# EAGLE design MKRCANShieldV2.0 (EAGLE 9.1.3)
DESCRIPTION: microOBD 200 OBD-II Module; HW_REV: 1.4; PCB_REV: C; PCB_SPEC1: Layer Count: 4; PCB_SPEC2: Size: 1.3" x 0.59"; PCB_SPEC3: Finish Thickness: 0.049" - 0.052"; PCB_SPEC4: Copper Weight: 1oz; TITLE: STM1120
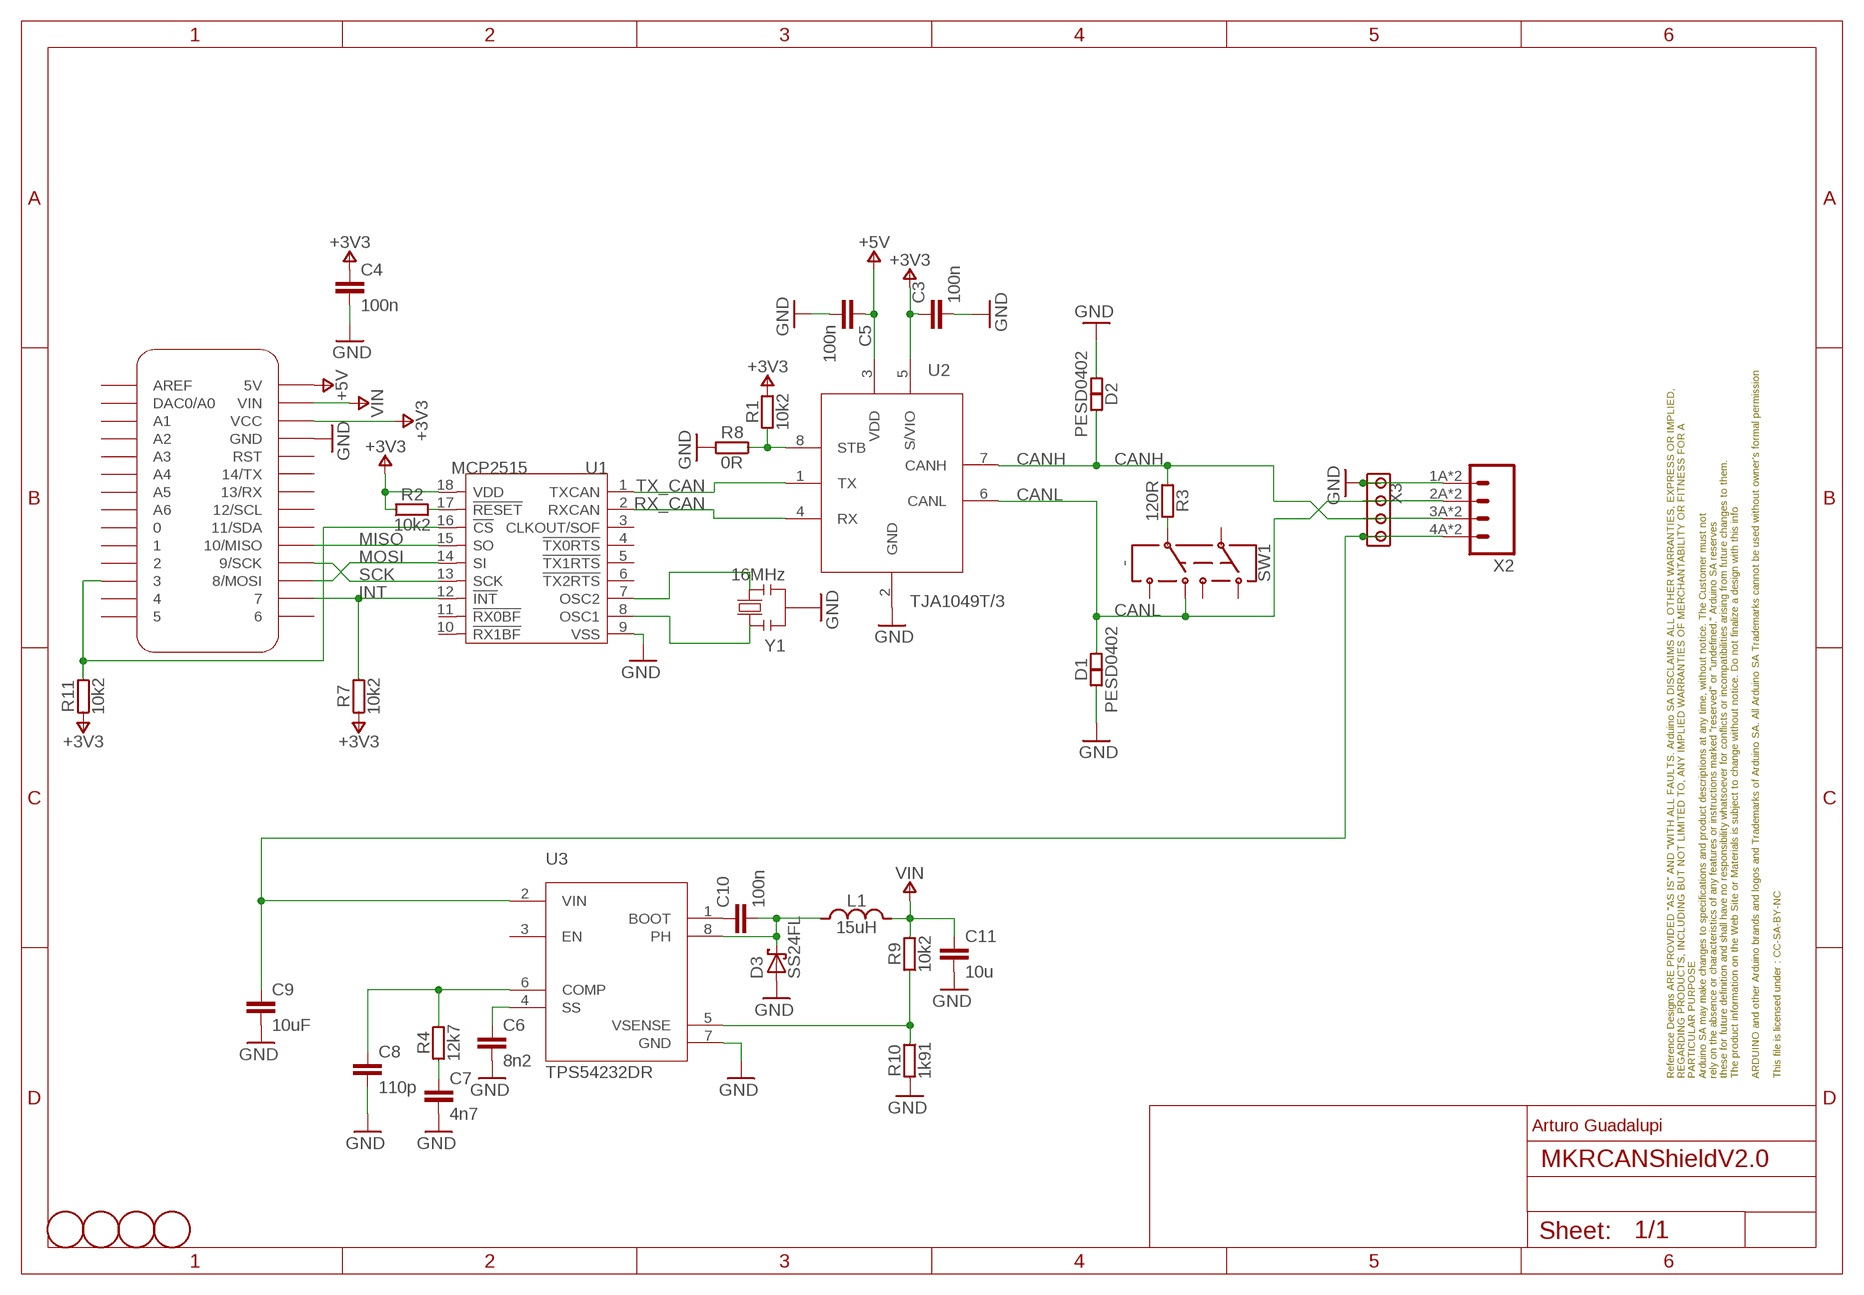
[diagram p0: schematic, sheet 1]

## Parts
C3  100n  C-100NF-0402  [0402-1005X55N]
C4  100n  C-100NF-0402  [0402-1005X55N]
C5  100n  C-100NF-0402  [0402-1005X55N]
C6  8n2  C-8N2-0402  [0402-1005X55N]
C7  4n7  C-4N7-0402  [0402-1005X55N]
C8  110p  C-110P-0402  [0402-1005X55N]
C9  10uF  C-10UF-1206  [C1206]
C10  100n  C-100NF-0402  [0402-1005X55N]
C11  10u  C-10UF-0603  [0603-1608X90N]
D1  PESD0402  PESD  [0402-1005X55N]
D2  PESD0402  PESD  [0402-1005X55N]
D3  SS24FL  [SOD123F]
FRAME1  DNP  A4L-LOC  [FRAME]
L1  15uH  LSRN  [SRN6045]
MKR1  -  MKRBOARD  [MKRBOARD-NH]
R1  10k2  R-10K2-0402  [0402-1005X55N]
R2  10k2  R-10K2-0402  [0402-1005X55N]
R3  120R  R-120R-0402  [0402-1005X55N]
R4  12k7  R-12K7-0402  [0402-1005X55N]
R7  10k2  R-10K2-0402  [0402-1005X55N]
R8  0R  R-0R-0402  [0402-1005X55N]
R9  10k2  R-10K2-0402  [0402-1005X55N]
R10  1k91  R-1K91-0402  [0402-1005X55N]
R11  10k2  R-10K2-0402  [0402-1005X55N]
SW1  -  CL-SB-22A-02T  [CL-SB-22A]
U1  MCP2515  MCP2515-SOIC18  [SOIC18]
U2  TJA1049T/3  TJA104X-9T/3  [SO08]
U3  TPS54232DR  TPS54232  [SO08]
U$1  DNP  FIDUCIAL-1.5MM  [FD-1-1.5]
U$4  DNP  FIDUCIAL-1.5MM  [FD-1-1.5]
U$6  DNP  FIDUCIAL-1.5MM  [FD-1-1.5]
U$13  DNP  FIDUCIAL-1.5MM  [FD-1-1.5]
X2  DNP  3.5MM-PCB-DNPPRESS  [SPTAF1/4-3.5-IL]
X3  -  SCREW4X2.54  [MODULINO-4]
Y1  16MHz  RESONATOR-16MHZMU  [RESONATOR]

## Nets
+3V3: C3.1 C4.1 MKR1.VCC R1.2 R2.2 R7.2 R11.2 U1.18(VDD) U2.5(S/VIO)
+5V: C5.1 MKR1.5V U2.3(VDD)
CANH: D2.2 R3.1 U2.7(CANH) X2.3A X2.3B X3.3
CANL: D1.2 SW1.P$4 U2.6(CANL) X2.2A X2.2B X3.2
GND: C3.2 C4.2 C5.2 C6.2 C7.2 C8.2 C9.2 C11.2 D1.1 D2.1 D3.A MKR1.GND R8.1 R10.1 U1.9(VSS) U2.2(GND) U3.7(GND) X2.1A X2.1B X3.1 Y1.2
INT: MKR1.7 R7.1 U1.12(!INT)
MISO: MKR1.10(10/MISO) U1.15(SO)
MOSI: MKR1.8(8/MOSI) U1.14(SI)
N$1: R3.2 SW1.P$5
N$2: C7.1 R4.1
N$4: R1.1 R8.2 U2.8(STB)
N$5: C8.1 R4.2 U3.6(COMP)
N$6: C6.1 U3.4(SS)
N$8: C9.1 U3.2(VIN) X2.4A X2.4B X3.4
N$9: C10.1 U3.1(BOOT)
N$10: C10.2 D3.C L1.1 U3.8(PH)
N$11: R9.1 R10.2 U3.5(VSENSE)
N$12: MKR1.3 R11.1 U1.16(!CS)
N$16: U1.7(OSC2) Y1.3
N$17: U1.8(OSC1) Y1.1
RST_N: R2.1 U1.17(!RESET)
RX_CAN: U1.2(RXCAN) U2.4(RX)
SCK: MKR1.9(9/SCK) U1.13(SCK)
TX_CAN: U1.1(TXCAN) U2.1(TX)
VIN: C11.1 L1.2 MKR1.VIN R9.2
Unconnected: MKR1.0 MKR1.1 MKR1.2 MKR1.4 MKR1.5 MKR1.6 MKR1.11(11/SDA) MKR1.12(12/SCL) MKR1.13(13/RX) MKR1.14(14/TX) MKR1.A0(DAC0/A0) MKR1.A1 MKR1.A2 MKR1.A3 MKR1.A4 MKR1.A5 MKR1.A6 MKR1.AREF MKR1.RST SW1.P$1 SW1.P$2 SW1.P$3 SW1.P$6 U1.3(CLKOUT/SOF) U1.4(!TX0RTS) U1.5(!TX1RTS) U1.6(!TX2RTS) U1.10(!RX1BF) U1.11(!RX0BF) U3.3(EN)

## Notes on the sheet
- Arturo Guadalupi

## Library data of the parts
C3-C5 C10 = Arduino-rcl:C: SMD Capacitor; CODE-ARDUINO: 0132; DATASHEET: http://www.tdk.com/pdf/TDKMLCCCapRange.pdf; DISTRIBUTOR-LINK: http://www.digikey.com/product-detail/en/tdk-corporation/C1005X5R1H104K050BB/445-5942-1-ND/2443982; DISTRIBUTOR-PN: 445-5942-1-ND; MANUFACTURER: TDK; MANUFACTURER-PN: C1005X5R1H104K050BB; NOTE: -
C6 = Arduino-rcl:C: SMD Capacitor; CODE-ARDUINO: 2263; DATASHEET: http://www.yageo.com/documents/recent/UPY-GPHC_X7R_6.3V-to-50V_18.pdf; DISTRIBUTOR-LINK: https://www.digikey.com/product-detail/en/yageo/CC0402KRX7R7BB822/311-1041-1-ND/302958; DISTRIBUTOR-PN: 311-1041-1-ND; MANUFACTURER: Yageo; MANUFACTURER-PN: CC0402KRX7R7BB822; NOTE: -
C7 = Arduino-rcl:C: SMD Capacitor; CODE-ARDUINO: 2266; DATASHEET: http://search.murata.co.jp/Ceramy/image/img/A01X/partnumbering_e_01.pdf; DISTRIBUTOR-LINK: https://www.digikey.com/product-detail/en/murata-electronics-north-america/GRM155R71H472KA01J/490-8259-1-ND/4380553; DISTRIBUTOR-PN: 490-8259-1-ND; MANUFACTURER: Murata; MANUFACTURER-PN: GRM155R71H472KA01J; NOTE: -
C8 = Arduino-rcl:C: SMD Capacitor; CODE-ARDUINO: 2264; DATASHEET: http://search.murata.co.jp/Ceramy/image/img/A01X/G101/ENG/GRM1555C1H111GA01-01.pdf; DISTRIBUTOR-LINK: https://www.digikey.com/product-detail/en/murata-electronics-north-america/GRM1555C1H111GA01D/490-6195-1-ND/3845392; DISTRIBUTOR-PN: 490-6195-1-ND; MANUFACTURER: Murata; MANUFACTURER-PN: GRM1555C1H111GA01D; NOTE: -
C9 = Arduino-rcl:C: SMD Capacitor; CODE-ARDUINO: 2227; DATASHEET: https://product.tdk.com/info/en/catalog/datasheets/mlcc_commercial_general_en.pdf; DISTRIBUTOR-LINK: https://www.digikey.com/product-detail/en/tdk-corporation/C3216X7R1V106M160AC/445-8034-1-ND/2792174; DISTRIBUTOR-PN: 445-8034-1-ND; MANUFACTURER: TDK Corporation; MANUFACTURER-PN: C3216X7R1V106M160AC; NOTE: -; RESTRICTIONS: >=25V
C11 = Arduino-rcl:C: SMD Capacitor; CODE-ARDUINO: 2213; DATASHEET: http://www.murata.com/~/media/webrenewal/support/library/catalog/products/capacitor/mlcc/c02e.pdf; DISTRIBUTOR-LINK: http://www.digikey.com/product-search/en?keywords=490-10728-1-ND; DISTRIBUTOR-PN: 490-10728-1-ND; MANUFACTURER: Murata; MANUFACTURER-PN: GRM188R61C106KAALD; NOTE: -
D1 D2 = Arduino-diodes:PESD: ESD protection; CODE-ARDUINO: 2280; DATASHEET: http://www.littelfuse.com/~/media/electronics/product_specifications/polymer_esd_suppressors/littelfuse_polymer_esd_suppressor_pesd0402_140_product_specification.pdf.pdf; DISTRIBUTOR-LINK: https://www.digikey.com/product-detail/en/littelfuse-inc/PESD0402-140/PESD0402-140CT-ND/1968526; DISTRIBUTOR-PN: PESD0402-140CT-ND; MANUFACTURER: Littlefuse; MANUFACTURER-PN: PESD0402-140
D3 = Arduino-diodes:SS24FL: Schotky diode; CODE-ARDUINO: 2262; DATASHEET: https://www.fairchildsemi.com/datasheets/SS/SS24FL.pdf; DISTRIBUTOR-LINK: https://www.digikey.com/product-detail/en/fairchild-on-semiconductor/SS24FL/SS24FLCT-ND/5305093; DISTRIBUTOR-PN: SS24FLCT-ND; MANUFACTURER: Fairchild; MANUFACTURER-PN: SS24FL
FRAME1 = Arduino-utility:A4L-LOC: FRAME DIN A4, landscape with location and doc. field; CODE-ARDUINO: DNP; DATASHEET: DNP; DISTRIBUTOR-LINK: DNP; DISTRIBUTOR-PN: DNP; MANUFACTURER: DNP; MANUFACTURER-PN: DNP
L1 = Arduino-rcl:L: Inductors; CODE-ARDUINO: 2261; DATASHEET: http://pdf1.alldatasheet.com/datasheet-pdf/view/442254/BOURNS/SRN6045-150M.html; DISTRIBUTOR-LINK: https://www.digikey.com/product-detail/en/bourns-inc/SRN6045-150M/SRN6045-150MCT-ND/2756165; DISTRIBUTOR-PN: SRN6045-150M; MANUFACTURER: Bourns; MANUFACTURER-PN: SRN6045-150M
MKR1 = Arduino-utility:MKRBOARD: MKR board footprint; CODE-ARDUINO: A5272 A5273; DATASHEET: -; DISTRIBUTOR-LINK: -; DISTRIBUTOR-PN: -; MANUFACTURER: -; MANUFACTURER-PN: 21TW331 21TW332; RESTRICTIONS: NO
R1 R2 R7 R9 R11 = Arduino-rcl:R: SMD Resistor; CODE-ARDUINO: 2265; DATASHEET: www.yageo.com.tw/exep/pages/download/literatures/PYu-R_INT-thick_7.pdf; DISTRIBUTOR-LINK: https://www.digikey.com/product-detail/en/yageo/RT0402DRD0710K2L/311-2129-1-ND/6128548; DISTRIBUTOR-PN: 311-2129-1-ND; MANUFACTURER: Yageo; MANUFACTURER-PN: RT0402DRD0710K2L; NOTE: NO
R3 = Arduino-rcl:R: SMD Resistor; CODE-ARDUINO: 2278; DATASHEET: www.yageo.com.tw/exep/pages/download/literatures/PYu-R_INT-thick_7.pdf; DISTRIBUTOR-LINK: https://www.digikey.com/product-detail/en/yageo/RC0402JR-07120RL/311-120JRCT-ND/2827967; DISTRIBUTOR-PN: 311-120JRCT-ND; MANUFACTURER: Yageo; MANUFACTURER-PN: RC0402JR-07120RL; NOTE: NO
R4 = Arduino-rcl:R: SMD Resistor; CODE-ARDUINO: 2260; DATASHEET: www.yageo.com.tw/exep/pages/download/literatures/PYu-R_INT-thick_7.pdf; DISTRIBUTOR-LINK: https://www.digikey.com/product-detail/en/yageo/RC0402FR-0712K7L/YAG2964CT-ND/5281829; DISTRIBUTOR-PN: YAG2964CT-ND; MANUFACTURER: Yageo; MANUFACTURER-PN: RC0402FR-0712K7L; NOTE: NO
R8 = Arduino-rcl:R: SMD Resistor; CODE-ARDUINO: 0039; DATASHEET: www.yageo.com.tw/exep/pages/download/literatures/PYu-R_INT-thick_7.pdf; DISTRIBUTOR-LINK: http://www.digikey.com/product-detail/en/yageo/RC0402FR-070RL/311-0.0LRCT-ND/2827888; DISTRIBUTOR-PN: 311-0.0LRCT-ND; MANUFACTURER: Yageo; MANUFACTURER-PN: RC0402FR-070RL; NOTE: NO
R10 = Arduino-rcl:R: SMD Resistor; CODE-ARDUINO: 2267; DATASHEET: www.yageo.com.tw/exep/pages/download/literatures/PYu-R_INT-thick_7.pdf; DISTRIBUTOR-LINK: https://www.digikey.com/product-detail/en/yageo/RC0402FR-071K91L/YAG3049CT-ND/5281914; DISTRIBUTOR-PN: YAG3049CT-ND; MANUFACTURER: Yageo; MANUFACTURER-PN: RC0402FR-071K91L; NOTE: NO
SW1 = Arduino-mechanical:CL-SB-22A-02T: Slide Switch DPDT Surface Mount; CODE-ARDUINO: A5281; DATASHEET: https://www.nidec-copal-electronics.com/e/catalog/switch/cl-sb.pdf; DISTRIBUTOR-LINK: https://www.digikey.se/products/en?keywords=563-1339-1-ND; DISTRIBUTOR-PN: 563-1339-1-ND; MANUFACTURER: Copal Electronics; MANUFACTURER-PN: CL-SB-22A-02T; RESTRICTIONS: NO
U1 = Arduino-ICs:MCP2515: Stand-Alone CAN Controller With SPI Interface; CODE-ARDUINO: 2277; DATASHEET: http://ww1.microchip.com/downloads/en/DeviceDoc/20001801H.pdf; DISTRIBUTOR-LINK: https://www.digikey.com/product-detail/en/microchip-technology/MCP2515T-I-SO/MCP2515T-I-SOCT-ND/4307902; DISTRIBUTOR-PN: MCP2515T-I/SOCT-ND; MANUFACTURER: Microchip; MANUFACTURER-PN: MCP2515T-I/SO; NOTE: NO
U2 = Arduino-ICs:TJA104X: CAN transceiver; CODE-ARDUINO: 2282; DATASHEET: https://www.nxp.com/docs/en/data-sheet/TJA1049.pdf; DISTRIBUTOR-LINK: https://www.digikey.com/products/en?keywords=TJA1049T%2F3; DISTRIBUTOR-PN: TJA1049T/3J-ND; MANUFACTURER: NXP; MANUFACTURER-PN: TJA1049T/3J; NOTE: NO
U3 = Arduino-ICs:TPS54232: Buck converter IC; CODE-ARDUINO: 5423; DATASHEET: http://www.ti.com/lit/ds/symlink/tps54232.pdf; DISTRIBUTOR-LINK: https://www.digikey.com/product-detail/en/texas-instruments/TPS54232DR/296-39414-1-ND/5143365; DISTRIBUTOR-PN: 296-39414-1-ND; MANUFACTURER: Texas Instruments; MANUFACTURER-PN: TPS54232DR; RESTRICTIONS: NO
U$1 U$4 U$6 U$13 = Arduino-utility:FIDUCIAL: Fiducial mount; CODE-ARDUINO: DNP; DATASHEET: DNP; DISTRIBUTOR-LINK: DNP; DISTRIBUTOR-PN: DNP; MANUFACTURER: DNP; MANUFACTURER-PN: DNP
X2 = Arduino-connectors:3.5MM-PCB: TERM BLOCK HDR 4POS VERT 3.5MM; CODE-ARDUINO: DNP; DATASHEET: DNP; DISTRIBUTOR-LINK: DNP; DISTRIBUTOR-PN: DNP; MANUFACTURER: DNP; MANUFACTURER-PN: DNP
X3 = Arduino-connectors:SCREW4X2.54: 4x2.54 Screw terminal block; CODE-ARDUINO: 2275; DATASHEET: http://www.on-shore.com/wp-content/uploads/2015/09/ostvnxxa150.pdf; DISTRIBUTOR-LINK: https://www.digikey.it/products/it?keywords=ED10563-ND; DISTRIBUTOR-PN: ED10563-ND; MANUFACTURER: On Shore; MANUFACTURER-PN: OSTVN04A150
Y1 = Arduino-crystals:RESONATOR: Resonator; CODE-ARDUINO: 0011; DATASHEET: http://www.murata.com/~/media/webrenewal/support/library/catalog/products/timingdevice/ceralock/p16e.ashx; DISTRIBUTOR-LINK: https://www.digikey.com/product-detail/it/murata-electronics-north-america/CSTCE16M0V53-R0/490-1198-1-ND/584635; DISTRIBUTOR-PN: 490-1198-1-ND; MANUFACTURER: Murata; MANUFACTURER-PN: CSTCE16M0V53-R0

## Board
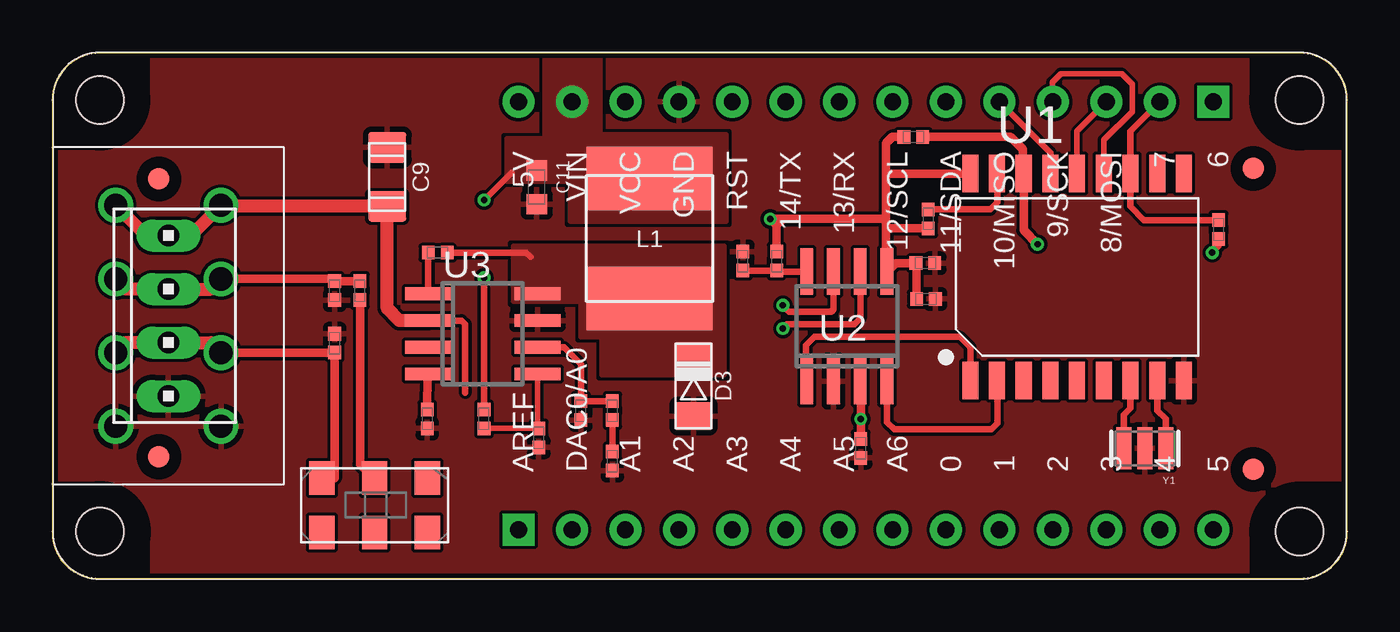
[diagram p1: board, top side]
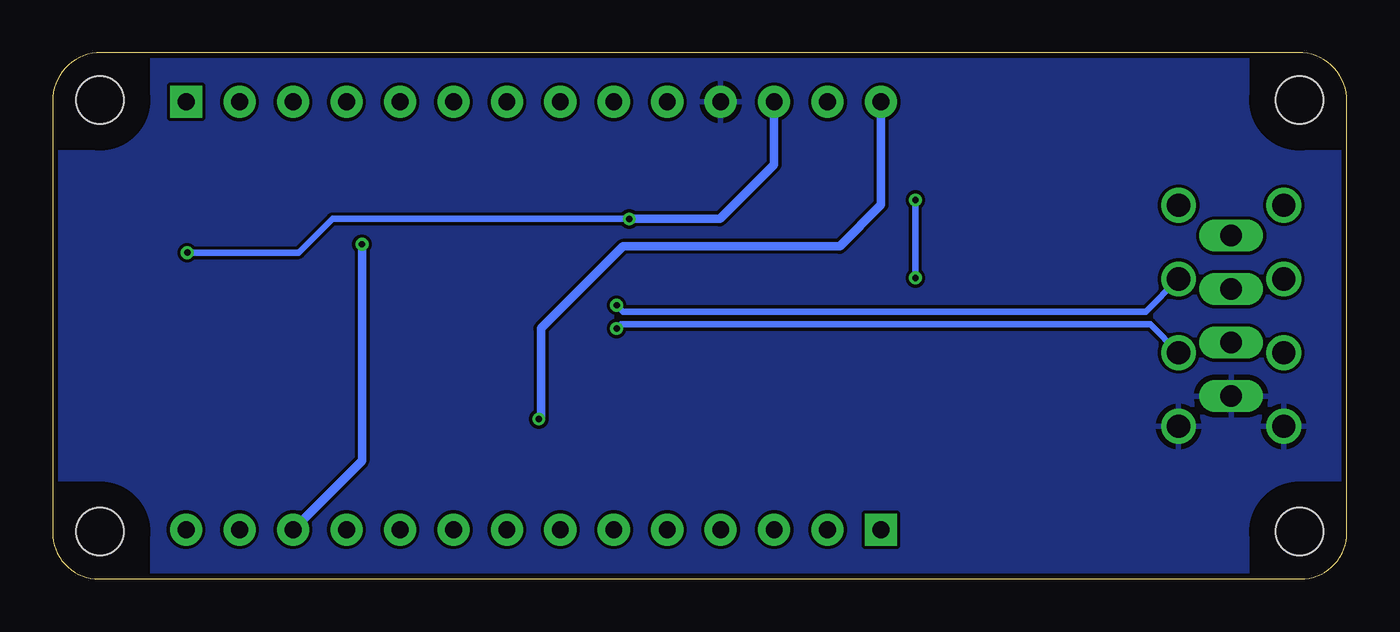
[diagram p2: board, bottom side, seen from below]

Size 61.5 x 25 mm. Coordinates in mm from the lower left corner, seen from the top.
Outline: 0,2.2 0,22.7 arc-90 2.3,25 59.2,25 arc-90 61.5,22.7 61.5,2.2 arc-90 59.3,0 2.2,0 arc-90 0,2.2
Copper layers (1*16): Top 0.035mm / dielectric 1.5mm / Bottom 0.035mm
Design rules "SeeedStudio_2layers": minimum track width 6mil, minimum drill 12mil, track to track 6mil, track to pad 6mil, pad to pad 6mil, via to via 6mil, smd to smd 0mil, copper to edge 10mil, drill to drill 10mil, minimum pad ring 10mil, minimum via ring 6mil, stop-mask expansion 2mil, vias tented up to drill 100mil, thermal gap 10mil
Holes 2.25 mm at 2.25,2.25 2.25,22.75 59.25,2.25 59.25,22.75
tRestrict: area 0,0 to 4.5,4.5; area 0,20.5 to 4.5,25; area 57,0 to 61.5,4.5; area 57,20.5 to 61.5,25; 8 lines
bRestrict: area 0,0 to 4.5,4.5; area 0,20.5 to 4.5,25; area 57,0 to 61.5,4.5; area 57,20.5 to 61.5,25; 8 lines

### Footprints (pad centres in the part's own frame; a part is rotated, then mirrored left to right if it is on the bottom)
0402-1005X55N = smd 0.62 x 0.62: 1 -0.45,0; 2 0.45,0
C1206 = smd 1.8 x 1.45: 1 0,1.4; 2 0,-1.4
0603-1608X90N = smd 0.95 x 1: 1 -0.8,0; 2 0.8,0
SOD123F = smd 1.8 x 1.34: A 0,-1.43; C 0,1.43
SRN6045 = smd 3 x 6: 1 -2.85,0; 2 2.85,0
MKRBOARD-NH = drill 0.8 pad 1.524: 0 42.455,2.34; 1 44.995,2.34; 2 47.535,2.34; 3 50.075,2.34; 4 52.615,2.34; 5 55.155,2.34; 5V 22.135,22.66; 7 52.615,22.66; 8 50.075,22.66; 9 47.535,22.66; 10 44.995,22.66; 11 42.455,22.66; 12 39.915,22.66; 13 37.375,22.66; 14 34.835,22.66; A0 24.675,2.34; A1 27.215,2.34; A2 29.755,2.34; A3 32.295,2.34; A4 34.835,2.34; A5 37.375,2.34; A6 39.915,2.34; GND 29.755,22.66; RST 32.295,22.66; VCC 27.215,22.66; VIN 24.675,22.66 | drill 0.8 pad 1.524 square: 6 55.155,22.66; AREF 22.135,2.34
CL-SB-22A = smd 1.2 x 1.6: P$1 -2.5,-1.29; P$2 0,-1.29; P$3 2.5,-1.29; P$4 -2.5,1.29; P$5 0,1.29; P$6 2.5,1.29
SOIC18 = smd 0.762 x 1.778: 1 -5.08,-4.915; 2 -3.81,-4.915; 3 -2.54,-4.915; 4 -1.27,-4.915; 5 0,-4.915; 6 1.27,-4.915; 7 2.54,-4.915; 8 3.81,-4.915; 9 5.08,-4.915; 10 5.08,4.915; 11 3.81,4.915; 12 2.54,4.915; 13 1.27,4.915; 14 0,4.915; 15 -1.27,4.915; 16 -2.54,4.915; 17 -3.81,4.915; 18 -5.08,4.915
SO08 = smd 0.6 x 2.2: 1 -1.905,-2.6; 2 -0.635,-2.6; 3 0.635,-2.6; 4 1.905,-2.6; 5 1.905,2.6; 6 0.635,2.6; 7 -0.635,2.6; 8 -1.905,2.6
FD-1-1.5 = smd 1.016 x 1.016: P$1 0,0
SPTAF1/4-3.5-IL = drill 1.1: 1A -5.25,-2.5; 1B -5.25,2.5; 2A -1.75,-2.5; 2B -1.75,2.5; 3A 1.75,-2.5; 3B 1.75,2.5; 4A 5.25,-2.5; 4B 5.25,2.5
MODULINO-4 = drill 1.016 long: 1 3.81,0; 2 1.27,0; 3 -1.27,0; 4 -3.81,0
RESONATOR = smd 0.7 x 2: 1 -1,0; 2 0,0; 3 1,0

### Placement (x,y rotation side)
C3  41.5,13.3 0 top
C4  41.47,15 0 top
C5  38.4,6.2 270 top
C6  17.8,7.6 270 top
C7  26.6,5.6 270 top
C8  25.1,8 270 top
C9  15.9,19.1 180 top
C10  18.3,15.5 0 top
C11  23,18.6 270 top
D1  13.4,11.2 270 top
D2  13.4,13.7 90 top
D3  30.45,9.17 0 top
FRAME1  -27.15,-11.3 0 top  (outside the outline)
L1  28.36,16.17 90 top
MKR1  0,0 0 top
R1  34.4,15.1 90 top
R2  41.6,17.1 270 top
R3  14.6,13.7 270 top
R4  26.6,8 90 top
R7  55.4,16.6 270 top
R8  32.8,15.1 270 top
R9  20.5,7.6 90 top
R10  23.1,6.7 90 top
R11  40.9,21 180 top
SW1  15.3,3.5 0 top
U1  48.68,14.34 0 top
U2  37.74,12 0 top
U3  20.44,11.64 270 top
U$1  57.05,5.2 0 top
U$4  57.05,19.5 0 top
U$6  5.05,5.8 0 top
U$13  5.05,19 0 top
X2  5.5,12.5 90 top
X3  5.5,12.5 270 top
Y1  51.9,6.2 180 top

### Tracks (layer width: path | path; a pad name or v marks a point on that pad's centre or on a via)
+3V3  (via drill 0.3)
  Top 0.305: R7.2 55.4,15.8 v55.1,15.5
  Top 0.406: C3.1 41.05,14.97 C4.1 40.05,15 U2.5 39.6,14.64 39.6,16.5 | R2.2 39.75,16.65 39.6,16.5 | R11.2 39.9,21 39.6,20.7 39.6,19.2 | 39.6,19.2 39.6,17 | 39.6,17 39.6,16.5 | U1.18 39.66,19.25 39.6,19.2 | R1.2 34.4,16.8 | 34.4,16.8 34.65,17.05 | 34.65,17.05 34.7,17.1 39.5,17.1 39.6,17 | 34.4,16.8 v34.1,17.1 34.6,17.1 34.65,17.05
  Bottom 0.305: v55.1,15.5 49.8,15.5 48.2,17.1 v34.1,17.1
  Bottom 0.406: MKR1.VCC 27.21,19.68 29.8,17.1 v34.1,17.1
+5V  (via drill 0.3)
  Top 0.406: C5.1 v38.4,7.6 38.4,9.38 U2.3
  Bottom 0.406: MKR1.5V 22.14,17.77 24.1,15.8 34.4,15.8 38.3,11.9 38.3,7.7 v38.4,7.6
CANH  (via drill 0.3)
  Top 0.305: U2.7 37.1,12.8 37,12.7 35,12.7 v34.7,13
  Top 0.406: X2.3A 13.1,14.25 D2.2 R3.1
  Top 0.61: X2.3A 7.52,13.77 X3.3 3.48,13.77 X2.3B
  Bottom 0.305: X2.3A 9.55,12.7 34.4,12.7 v34.7,13
CANL  (via drill 0.3)
  Top 0.305: U2.6 38.38,12.38 38.1,12.1 34.9,12.1 v34.7,11.9
  Top 0.406: SW1.P$4 13.4,4.79 D1.2 X2.2A
  Top 0.61: X2.2B 3.48,11.23 X3.2 7.52,11.23 X2.2A
  Bottom 0.305: v34.7,11.9 34.5,12.1 9.35,12.1 X2.2A
GND
  pour Bottom: 0,25 61.5,25 61.5,0 0,0
  pour Top (rank 6): 0,25 61.5,25 61.5,0 0,0
INT
  Top 0.305: MKR1.7 51.22,21.27 U1.12 51.2,19.23 51.2,17.7 51.85,17.05 R7.1
MISO
  Top 0.305: U1.15 47.41,20.25 MKR1.10
MOSI
  Top 0.254: U1.14 48.68,21.27 MKR1.8
N$1
  Top 0.406: R3.2 14.6,5.44 SW1.P$5
N$2
  Top 0.305: R4.1 C7.1
N$4
  Top 0.305: U2.8 34.45,14.6 R1.1 R8.2
N$5
  Top 0.305: U3.6 24.3,11.01 25.1,10.2 C8.1 R4.2
N$6
  Top 0.406: C6.1 17.82,9.75 U3.4
N$8
  Top 0.305: U3.2 19.43,12.28 19.6,12.1 19.6,8.85
  Top 0.61: X2.4B 4.44,16.31 X3.4 6.56,16.31 X2.4A 8.05,17.7 C9.1 15.9,12.85 16.48,12.28 U3.2
N$9
  Top 0.305: C10.1 17.85,13.55 U3.1
N$10
  Top 0.305: C10.2 22.5,15.5 22.7,15.3
  pour Top (no thermals): 21.9,13.2 21.9,15.8 31.9,15.8 31.9,9.7 26.1,9.7 26.1,11.5 25.1,11.5 25.1,13.2
N$11
  Top 0.254: R9.1 R10.2 23.04,7.41 U3.5
N$12  (via drill 0.3)
  Top 0.406: v46.8,15.9 46.14,16.56 U1.16 46.1,19.3 46.1,20.4 45.5,21 R11.1
  Bottom 0.406: v46.8,15.9 46.8,5.62 MKR1.3
N$16
  Top 0.305: Y1.3 50.9,7.8 51.2,8.1 51.2,9.4 U1.7
N$17
  Top 0.305: Y1.1 52.9,7.6 52.5,8 52.5,9.41 U1.8
RST_N
  Top 0.305: R2.1 44.55,17.55 44.9,17.9 44.9,19.23 U1.17
RX_CAN
  Top 0.305: U2.4 39.65,7.46 40,7.1 44.6,7.1 44.9,7.4 44.9,9.39 U1.2
SCK
  Top 0.254: U1.13 49.95,20.85 51.3,22.2 51.3,23.5 50.8,24 47.9,24 47.5,23.6 47.5,22.7 MKR1.9
TX_CAN
  Top 0.305: U1.1 43.6,11 43.1,11.5 36.2,11.5 35.8,11.1 35.8,9.46 U2.1
VIN  (via drill 0.3)
  Top 0.305: R9.2 v20.5,14.3 | v20.5,18 21.8,19.3
  Bottom 0.305: v20.5,14.3 v20.5,18
  pour Top (no thermals): 23.4,25 23.4,20.9 21.6,20.9 21.6,18.9 24.6,18.9 24.6,17 32,17 32,21.1 26,21.1 26,25

### Text on the board
Notes: Arturo Guadalupi